# Altium project SimpleFOC-A.PrjPcb
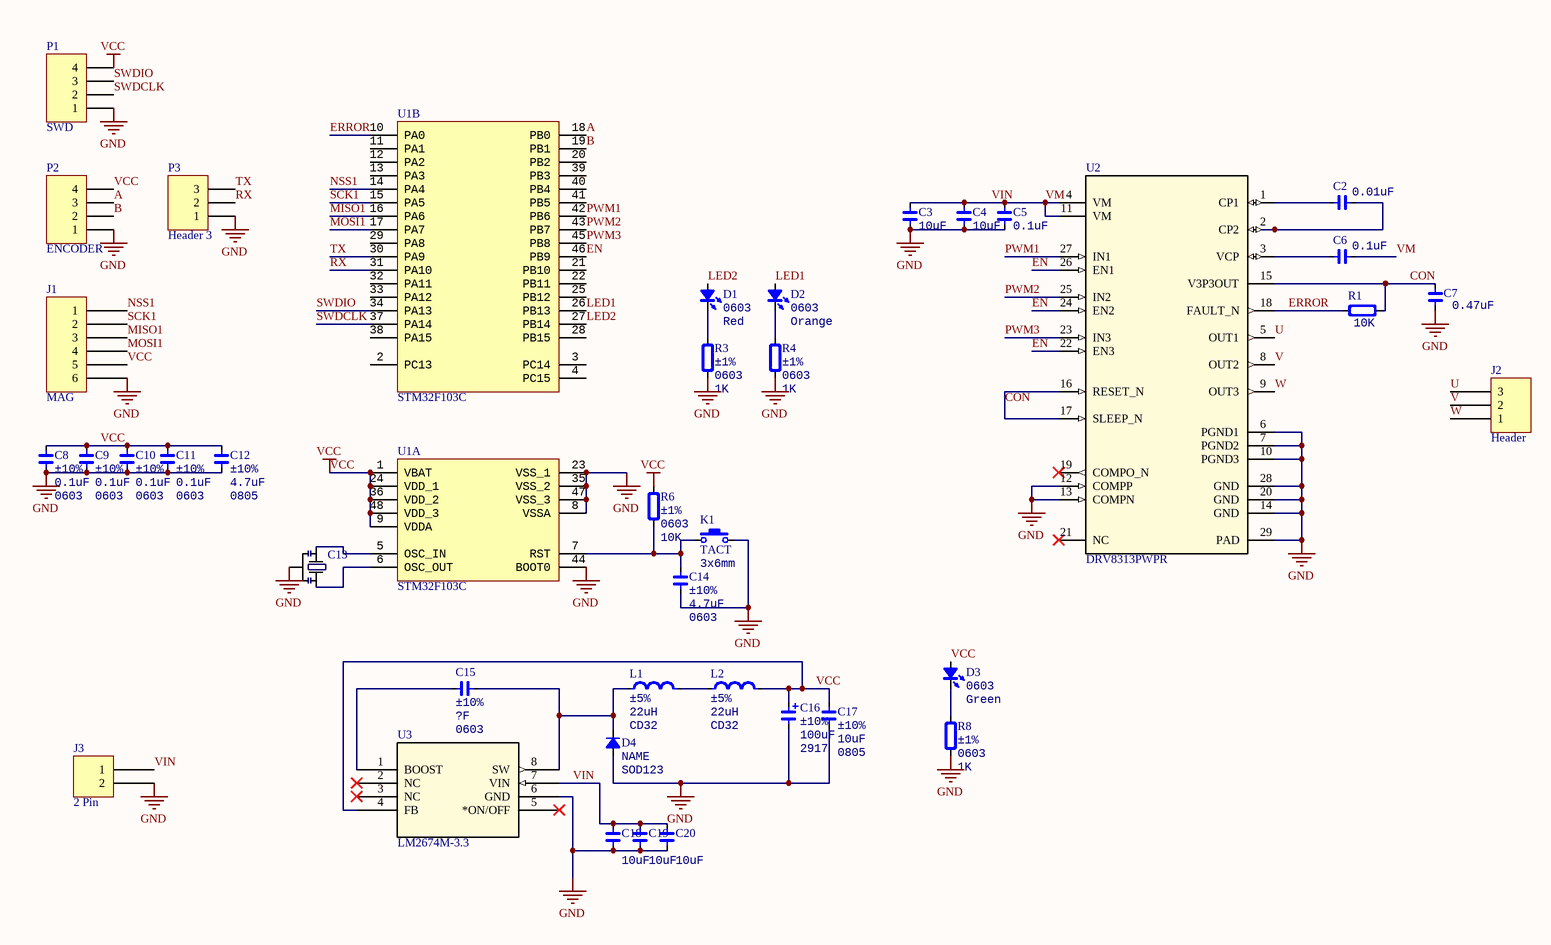
[diagram p0: simplefoc.SchDoc]
1 sheet, 40 parts. Net scope: global (net labels, ports and power ports of the same name join across sheets).
Board file: PCB1.PcbDoc

## Sheet simplefoc.SchDoc
size A3

### Parts
C2  value 0.01uF  [CAP_0603]  (hidden comment: C0603)
C3  value 10uF  [CAP_0805]  (hidden comment: C0805)
C4  value 10uF  [CAP_0805]  (hidden comment: C0805)
C5  value 0.1uF  [CAP_0603]  (hidden comment: C0603)
C6  value 0.1uF  [CAP_0603]  (hidden comment: C0603)
C7  value 0.47uF  [CAP_0603]  (hidden comment: C0603)
C8  value 0.1uF  Note: ±10%  Type: 0603  [CAP_0603]  (hidden comment: C0603)
C9  value 0.1uF  Note: ±10%  Type: 0603  [CAP_0603]  (hidden comment: C0603)
C10  value 0.1uF  Note: ±10%  Type: 0603  [CAP_0603]  (hidden comment: C0603)
C11  value 0.1uF  Note: ±10%  Type: 0603  [CAP_0603]  (hidden comment: C0603)
C12  value 4.7uF  Note: ±10%  Type: 0805  [CAP_0805]  (hidden comment: C0805)
C13  CSTCE8M00G52-R0  [CSTCE_MUR]  (value not drawn)
C14  value 4.7uF  Note: ±10%  Type: 0603  [CAP_0603]  (hidden comment: C0603)
C15  value ?F  Note: ±10%  Type: 0603  [CAP_0603]  (hidden comment: C0603)
C16  value 100uF  Note: ±10%  Type: 2917  [CAP_TAN_D2917]  (hidden comment: C2917)
C17  value 10uF  Note: ±10%  Type: 0805  [CAP_0805]  (hidden comment: C0805)
C18  value 10uF  [CAP_0805]  (hidden comment: C0805)
C19  value 10uF  [CAP_0805]  (hidden comment: C0805)
C20  value 10uF  [CAP_0805]  (hidden comment: C0805)
D1  value Red  Type: 0603  [LED_0603_RED]  (hidden comment: D0603)
D2  value Orange  Type: 0603  [LED_0603_RED]  (hidden comment: D0603)
D3  value Green  Type: 0603  [LED_0603_RED]  (hidden comment: D0603)
D4  Type: SOD123  [SOD-123]  (hidden comment: NAME)
J1  MAG  [JST BM06B-GHS-TBT]
J2  Header  [Motor_WIRE_3]
J3  2 Pin  [MOLEX KK 0022272021]
K1  TACT  value 3x6mm  [ButtonTACT_3x6x2.5_180]
L1  value 22uH  Note: ±5%  [IND_CD32]  (hidden comment: CD32)
L2  value 22uH  Note: ±5%  [IND_CD32]  (hidden comment: CD32)
P1  SWD  [HDR1X4]
P2  ENCODER  [HDR1X4]
P3  Header 3  [HDR1X3]
R1  value 10K  [RES_0603]  (hidden comment: R0603)
R3  value 1K  Note: ±1%  Type: 0603  [RES_0603]  (hidden comment: R0603)
R4  value 1K  Note: ±1%  Type: 0603  [RES_0603]  (hidden comment: R0603)
R6  value 10K  Note: ±1%  Type: 0603  [RES_0603]  (hidden comment: R0603)
R8  value 1K  Note: ±1%  Type: 0603  [RES_0603]  (hidden comment: R0603)
U1  STM32F103C  [LQFP_P0.5_48]  (parts A,B of 2)
U2  DRV8313PWPR  [PWP0028F_N]
U3  LM2674M-3.3  [M08A_TEX]

### Nets
GND: C3.1 C4.1 C5.1 C7.1 C8.1 C9.1 C10.1 C11.1 C12.1 C13.2 C14.1 C16.2 C17.1 C18.1 C19.1 C20.1 D4.1(A) J1.6 J3.2 K1.1 P1.1 P2.1 P3.1 R3.1 R4.1 R8.1 U1.8(VSSA) U1.23(VSS_1) U1.35(VSS_2) U1.44(BOOT0) U1.47(VSS_3) U2.6(PGND1) U2.7(PGND2) U2.10(PGND3) U2.12(COMPP) U2.13(COMPN) U2.14(GND) U2.20(GND) U2.28(GND) U2.29(PAD) U3.6(GND)
VCC: C8.2 C9.2 C10.2 C11.2 C12.2 C16.1 C17.2 D3.1(A) J1.5 L2.2 P1.4 P2.4 R6.2 U1.1(VBAT) U1.9(VDDA) U1.24(VDD_1) U1.36(VDD_2) U1.48(VDD_3) U3.4(FB)
A: P2.3 U1.18(PB0)
B: P2.2 U1.19(PB1)
CON: C7.2 R1.2 U2.15(V3P3OUT) U2.16(RESET_N) U2.17(SLEEP_N)
EN: U1.46(PB9) U2.22(EN3) U2.24(EN2) U2.26(EN1)
ERROR: R1.1 U1.10(PA0) U2.18(FAULT_N)
LED1: D2.1(A) U1.26(PB13)
LED2: D1.1(A) U1.27(PB14)
MISO1: J1.3 U1.16(PA6)
MOSI1: J1.4 U1.17(PA7)
NSS1: J1.1 U1.14(PA4)
PWM1: U1.42(PB6) U2.27(IN1)
PWM2: U1.43(PB7) U2.25(IN2)
PWM3: U1.45(PB8) U2.23(IN3)
RX: P3.2 U1.31(PA10)
SCK1: J1.2 U1.15(PA5)
SWDCLK: P1.2 U1.37(PA14)
SWDIO: P1.3 U1.34(PA13)
TX: P3.3 U1.30(PA9)
U: J2.3 U2.5(OUT1)
V: J2.2 U2.8(OUT2)
VIN: C3.2 C4.2 C5.2 C6.2 C18.2 C19.2 C20.2 J3.1 U2.4(VM) U2.11(VM) U3.7(VIN)  [also labelled VM]
W: J2.1 U2.9(OUT3)
NetC2_1: C2.1 U2.1(CP1)
NetC2_2: C2.2 U2.2(CP2)
NetC6_1: C6.1 U2.3(VCP)
NetC13_1: C13.1 U1.5(OSC_IN)
NetC13_3: C13.3 U1.6(OSC_OUT)
NetC14_2: C14.2 K1.2 R6.1 U1.7(RST)
NetC15_1: C15.1 U3.1(BOOST)
NetC15_2: C15.2 D4.2(K) L1.1 U3.8(SW)
NetD1_2: D1.2(K) R3.2
NetD2_2: D2.2(K) R4.2
NetD3_2: D3.2(K) R8.2
NetL1_2: L1.2 L2.1

Not connected (* = marked no-connect by the designer): U1 2(PC13) 3(PC14) 4(PC15) 11(PA1) 12(PA2) 13(PA3) 20(PB2) 21(PB10) 22(PB11) 25(PB12) 28(PB15) 29(PA8) 32(PA11) 33(PA12) 38(PA15) 39(PB3) 40(PB4) 41(PB5); U2 19(COMPO_N)* 21(NC)*; U3 2(NC)* 3(NC)* 5(*ON/OFF)*

### Library data of the parts
C2 C5-C7 = Cap_0603: Capacitor; Specification: X7R, ±10%, 16V; Note: ±10%; Type: 0603; Manufacturer: *
C3 C4 C18-C20 = Cap_0805: Capacitor; Specification: X7R, ±10%, 16V; Note: ±10%; Type: 0805; Manufacturer: *
C8-C11 C14 C15 = Cap_0603: Capacitor; Specification: X7R, ±10%, 16V; Manufacturer: *
C12 C17 = Cap_0805: Capacitor; Specification: X7R, ±10%, 16V; Manufacturer: *
C13 = CSTCE8M00G52-R0: No Description Available; Vendor: Murata; Built_By: EMA_UL_Team; SourceLibrary: Murata_2017-04-18; Type: DEV; Manufacturer_Part_Number: CSTCE8M00G52-R0; Copyright: Copyright (C) 2018 Accelerated Designs. All rights reserved; RefDes: RefDes
C16 = Cap_Tan_2917: Capacitor Tantalum; Specification: X7R, ±10%, 16V; Manufacturer: *
D1-D3 = LED_0603: LED; Manufacturer: *; Specification: *; Note: *
D4 = Diode_SOD123: Diode; Manufacturer: *; Specification: *; Note: *; Value: NAME
J1 = 6 Pin
J2 = 3 Pin
K1 = ButtonTACT_180_3x6x2.5: Button; type: TACT 2P
L1 L2 = Ind_CD32: Power Inductor; Specification: High frequency chip inductor ±5%; Manufacturer: *; Type: CD32
P1 P2 = Header 4: Header, 4-Pin; LatestRevisionDate: 17-Jul-2002; LatestRevisionNote: Re-released for DXP Platform.; Publisher: Altium Limited
P3 = Header 3: Header, 3-Pin; LatestRevisionDate: 17-Jul-2002; LatestRevisionNote: Re-released for DXP Platform.; Publisher: Altium Limited
R1 = Res_0603: Resistor; Specification: ±1%; Manufacturer: *; Note: ±1%; Type: 0603
R3 R4 R6 R8 = Res_0603: Resistor; Manufacturer: *; Specification: ±1%
U1 = STM32F103C: MCU ST; Manufacturer: STMicroelectronics; Note: CortexM3; Type: LQFP48 P0.5; Specification: *; Value: *
U2 = DRV8313PWPR: No Description Available; Manufacturer: Texas Instruments; PartNumber: DRV8313PWPR; RefDes: RefDes; Type: DEV; Value: Value; Copyright: Copyright (C) 2018 Accelerated Designs. All rights reserved
U3 = LM2674M-3.3: No Description Available; Vendor: Texas Instruments; Built_By: EMA_UL_Team; SourceLibrary: National_2011-09-26; Manufacturer_Part_Number: LM2674M-3.3; Copyright: Copyright (C) 2018 Accelerated Designs. All rights reserved; RefDes: RefDes; Type: DEV